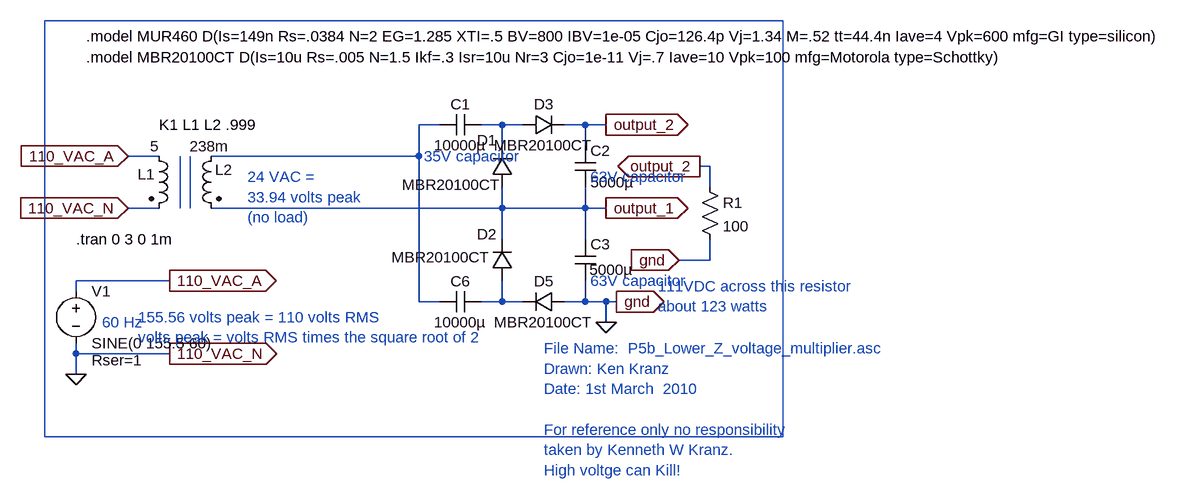
[diagram p0: schematic P5b_Lower_z_voltage_multiplier.asc]
P5b_Lower_z_voltage_multiplier.asc, the LTspice schematic file:
Version 4
SHEET 1 2468 1348
WIRE 192 448 160 448
WIRE 288 448 256 448
WIRE 320 448 288 448
WIRE 416 448 384 448
WIRE 448 448 416 448
WIRE 288 480 288 448
WIRE 416 480 416 448
WIRE -240 496 -288 496
WIRE 160 496 160 448
WIRE 160 496 -160 496
WIRE 608 512 592 512
WIRE 608 544 608 512
WIRE -240 576 -288 576
WIRE 288 576 288 544
WIRE 288 576 -160 576
WIRE 416 576 416 544
WIRE 416 576 288 576
WIRE 448 576 416 576
WIRE 288 624 288 576
WIRE 416 624 416 576
WIRE 608 656 608 624
WIRE 608 656 560 656
WIRE -224 688 -368 688
WIRE -368 704 -368 688
WIRE 160 720 160 496
WIRE 192 720 160 720
WIRE 288 720 288 688
WIRE 288 720 256 720
WIRE 320 720 288 720
WIRE 416 720 416 688
WIRE 416 720 384 720
WIRE 448 720 416 720
WIRE 464 720 448 720
WIRE 448 752 448 720
WIRE -368 800 -368 784
WIRE -224 800 -368 800
WIRE -368 832 -368 800
FLAG -288 496 110_VAC_A
IOPIN -288 496 In
FLAG -288 576 110_VAC_N
IOPIN -288 576 In
FLAG -368 832 0
FLAG -224 688 110_VAC_A
IOPIN -224 688 Out
FLAG -224 800 110_VAC_N
IOPIN -224 800 Out
FLAG 448 448 output_2
IOPIN 448 448 Out
FLAG 448 576 output_1
IOPIN 448 576 Out
FLAG 560 656 gnd
IOPIN 560 656 In
FLAG 448 752 0
FLAG 592 512 output_2
IOPIN 592 512 Out
FLAG 464 720 gnd
IOPIN 464 720 Out
SYMBOL ind2 -256 480 R0
WINDOW 0 -17 44 Left 0
WINDOW 3 2 1 Left 0
SYMATTR InstName L1
SYMATTR Value 5
SYMATTR Type ind
SYMATTR SpiceLine Rser=2
SYMBOL ind2 -144 480 M0
WINDOW 0 -17 37 Left 0
WINDOW 3 -12 1 Left 0
SYMATTR InstName L2
SYMATTR Value 238m
SYMATTR Type ind
SYMATTR SpiceLine Rser=100m
SYMBOL voltage -368 688 R0
WINDOW 123 0 0 Left 0
WINDOW 39 24 122 Left 0
SYMATTR SpiceLine Rser=1
SYMATTR InstName V1
SYMATTR Value SINE(0 155.5 60)
SYMBOL cap 400 480 R0
SYMATTR InstName C2
SYMATTR Value 5000µ
SYMATTR SpiceLine Rser=50m
SYMBOL cap 256 432 R90
WINDOW 0 0 32 VBottom 0
WINDOW 3 32 32 VTop 0
SYMATTR InstName C1
SYMATTR Value 10000µ
SYMATTR SpiceLine Rser=50m
SYMBOL diode 304 688 R180
WINDOW 0 24 72 Left 0
WINDOW 3 33 36 Left 0
SYMATTR InstName D2
SYMATTR Value MBR20100CT
SYMBOL cap 400 624 R0
WINDOW 3 22 47 Left 0
SYMATTR Value 5000µ
SYMATTR InstName C3
SYMATTR SpiceLine Rser=50m
SYMBOL cap 256 704 R90
WINDOW 0 0 32 VBottom 0
WINDOW 3 32 32 VTop 0
SYMATTR InstName C6
SYMATTR Value 10000µ
SYMATTR SpiceLine Rser=50m
SYMBOL res 592 528 R0
SYMATTR InstName R1
SYMATTR Value 100
SYMBOL diode 304 544 R180
WINDOW 0 24 72 Left 0
WINDOW 3 17 4 Left 0
SYMATTR InstName D1
SYMATTR Value MBR20100CT
SYMBOL diode 320 464 R270
WINDOW 0 32 32 VTop 0
WINDOW 3 0 32 VBottom 0
SYMATTR InstName D3
SYMATTR Value MBR20100CT
SYMBOL diode 384 704 R90
WINDOW 0 0 32 VBottom 0
WINDOW 3 32 32 VTop 0
SYMATTR InstName D5
SYMATTR Value MBR20100CT
TEXT -368 624 Left 0 !.tran 0 3 0 1m
TEXT -240 448 Left 0 !K1 L1 L2 .999
TEXT -272 744 Left 0 ;155.56 volts peak = 110 volts RMS\nvolts peak = volts RMS times the square root of 2
TEXT -328 752 Left 0 ;60 Hz
TEXT -104 528 Left 0 ;24 VAC = \n33.94 volts peak\n(no load)
TEXT 424 528 Left 0 ;63V capacitor
TEXT 168 496 Left 0 ;35V capacitor
TEXT 424 688 Left 0 ;63V capacitor
TEXT 528 696 Left 0 ;111VDC across this resistor\nabout 123 watts
TEXT -352 344 Left 0 !.model MBR20100CT D(Is=10u Rs=.005 N=1.5 Ikf=.3 Isr=10u Nr=3 Cjo=1e-11 Vj=.7 Iave=10 Vpk=100 mfg=Motorola type=Schottky)
TEXT -352 312 Left 0 !.model MUR460 D(Is=149n Rs=.0384 N=2 EG=1.285 XTI=.5 BV=800 IBV=1e-05 Cjo=126.4p Vj=1.34 M=.52 tt=44.4n Iave=4 Vpk=600 mfg=GI type=silicon)
TEXT 352 792 Left 0 ;File Name:  P5b_Lower_Z_voltage_multiplier.asc\nDrawn: Ken Kranz\nDate: 1st March  2010\n \nFor reference only no responsibility\ntaken by Kenneth W Kranz.\nHigh voltge can Kill!
LINE Normal -208 576 -208 496
LINE Normal -192 576 -192 496
RECTANGLE Normal 720 928 -416 288

The netlist it stands for:
* P5b_Lower_z_voltage_multiplier.asc
L1 110_VAC_A 0 5 Rser=2
L2 N001 output_1 238m Rser=100m
V1 110_VAC_A 0 SINE(0 155.5 60) Rser=1
C2 output_2 output_1 5000µ Rser=50m
C1 N002 N001 10000µ Rser=50m
D2 N003 output_1 MBR20100CT
C3 output_1 0 5000µ Rser=50m
C6 N003 N001 10000µ Rser=50m
R1 output_2 0 100
D1 output_1 N002 MBR20100CT
D3 N002 output_2 MBR20100CT
D5 0 N003 MBR20100CT
.model D D
.lib standard.dio
.tran 0 3 0 1m
K1 L1 L2 .999
* 155.56 volts peak = 110 volts RMS
* volts peak = volts RMS times the square root of 2
* 60 Hz
* 24 VAC =
* 33.94 volts peak
* (no load)
* 63V capacitor
* 35V capacitor
* 63V capacitor
* 111VDC across this resistor
* about 123 watts
.model MBR20100CT D(Is=10u Rs=.005 N=1.5 Ikf=.3 Isr=10u Nr=3 Cjo=1e-11 Vj=.7 Iave=10 Vpk=100 mfg=Motorola type=Schottky)
.model MUR460 D(Is=149n Rs=.0384 N=2 EG=1.285 XTI=.5 BV=800 IBV=1e-05 Cjo=126.4p Vj=1.34 M=.52 tt=44.4n Iave=4 Vpk=600 mfg=GI type=silicon)
* File Name:  P5b_Lower_Z_voltage_multiplier.asc
* Drawn: Ken Kranz
* Date: 1st March  2010
* For reference only no responsibility
* taken by Kenneth W Kranz.
* High voltge can Kill!
.backanno
.end